# Altium schematic sheet Sheet1.SchDoc
size A4; SheetNumber: 1; SheetTotal: 1
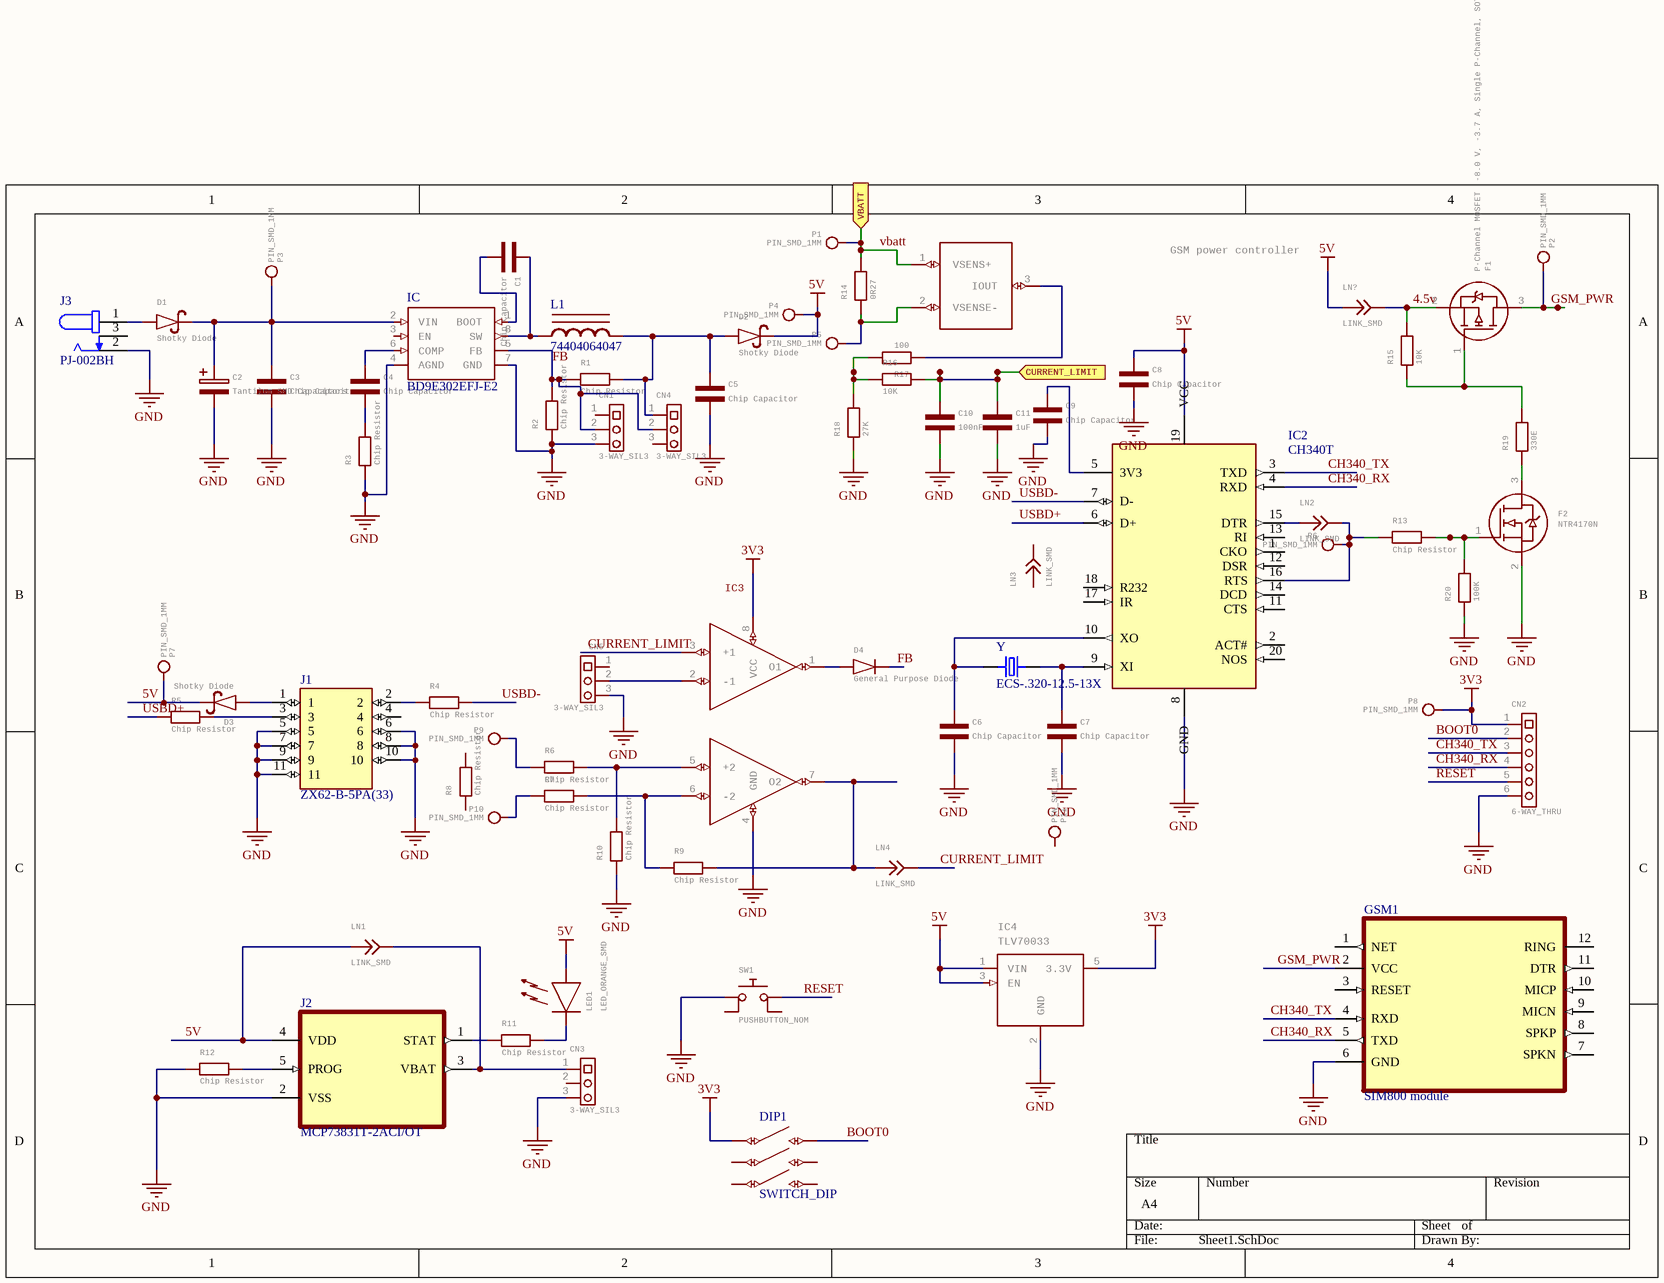
[diagram p0: Sheet1.SchDoc]

## Parts
C1  Chip Capacitor  [C0603]
C2  Tantilum SMD Capacitors  [CT3216]
C3  Chip Capacitor  [C0603]
C4  Chip Capacitor  [PPS_H]
C5  Chip Capacitor  [1210]
C6  Chip Capacitor  [L0402]
C7  Chip Capacitor  [L0402]
C8  Chip Capacitor  [C0603]
C9  Chip Capacitor  [PPS_H]
C10  100nF  [C0603]
C11  1uF  [C0805]
CN1  3-WAY_SIL3  [SIL_3]
CN2  6-WAY_THRU  [SIL6_2MM]
CN3  3-WAY_SIL3  [SIL_3]
CN4  3-WAY_SIL3  [SIL_3]
CN5  3-WAY_SIL3  [SIL_3]
D1  Shotky Diode  [SMB]
D2  Shotky Diode  [SMB]
D3  Shotky Diode  [SMB]
D4  General Purpose Diode  [SOD80]
DIP1  SWITCH_DIP  [DIP_SW6]
F1  P-Channel MOSFET  -8.0 V, -3.7 A, Single P-Channel, SOT-23  [SOT23]
F2  NTR4170N  [SOT23]
GSM1  SIM800 module  [SIM800L]
IC  BD9E302EFJ-E2  [SOIC127P600X100-9N]
IC1  ZXCT1107  [SOT23]  (value not drawn)
IC2  CH340T  [SOP63P599X175-20N]
IC3  LM393  [SOIC_8]  (value not drawn)
IC4  TLV70033  [SOT23-5L]
J1  ZX62-B-5PA(33)  [ZX62B5PA33]
J2  MCP73831T-2ACI/OT  [SOT23-5L]
J3  PJ-002BH  [CUI_PJ-002BH]
L1  74404064047  [74404064047]
LED1  LED_ORANGE_SMD  [L0805]
LN1  LINK_SMD  [LINK_SMD]
LN2  LINK_SMD  [LINK_SMD]
LN3  LINK_SMD  [LINK_SMD]
LN4  LINK_SMD  [LINK_SMD]
LN?  LINK_SMD  [LINK_SMD]
P1  PIN_SMD_1MM  [PAD_SMD_1MM]
P2  PIN_SMD_1MM  [PAD_SMD_1MM]
P3  PIN_SMD_1MM  [PAD_SMD_1MM]
P4  PIN_SMD_1MM  [PAD_SMD_1MM]
P5  PIN_SMD_1MM  [PAD_SMD_1MM]
P6  PIN_SMD_1MM  [PAD_SMD_1MM]
P7  PIN_SMD_1MM  [PAD_SMD_1MM]
P8  PIN_SMD_1MM  [PAD_SMD_1MM]
P9  PIN_SMD_1MM  [PAD_SMD_1MM]
P10  PIN_SMD_1MM  [PAD_SMD_1MM]
P11  PIN_SMD_1MM  [PAD_SMD_1MM]
R1  Chip Resistor  [R0603]
R2  Chip Resistor  [R0603]
R3  Chip Resistor  [R0603]
R4  Chip Resistor  [R0603]
R5  Chip Resistor  [R0603]
R6  Chip Resistor  [R0603]
R7  Chip Resistor  [R0603]
R8  Chip Resistor  [R1206]
R9  Chip Resistor  [R0603]
R10  Chip Resistor  [R0603]
R11  Chip Resistor  [R0603]
R12  Chip Resistor  [R0603]
R13  Chip Resistor  [R0603]
R14  0R27  [R1206]
R15  10K  [R0603]
R16  10K  [R0603]
R17  100  [R0603]
R18  27K  [R0603]
R19  330E  [R0603]
R20  100K  [R0603]
SW1  PUSHBUTTON_NOM  [TACTILE_SMD]
Y  ECS-.320-12.5-13X  [XTAL_ECS-200-20-1X]

## Ports
CURRENT_LIMIT (in), VBATT (in)

## Nets
3V3: CN2.1 DIP1.1 IC3.8(VCC) IC4.5(3.3V) P8.1
5V: C8.1 D2.C(K) D3.C(K) IC4.1(VIN) IC4.3(EN) J2.4(VDD) LED1.A LN1.2 LN?.2 P4.1 P7.1
GND: C2.2 C3.2 C5.2 C6.2 C7.2 C8.2 C9.2 C10.2 C11.2 CN1.3 CN2.6 CN3.3 CN5.3 F2.2(S) GSM1.6(GND) IC.4(AGND) IC.7(GND) IC3.4(GND) IC4.2(GND) J1.5 J1.6 J1.7 J1.8 J1.9 J1.10 J1.11 J2.2(VSS) J3.2 R2.1 R3.1 R10.1 R12.1 R18.1 R20.1 SW1.1
4.5v: F1.2(S) LN?.1 R15.2
BOOT0: CN2.2 DIP1.6
CH340_RX: CN2.4 GSM1.5(TXD) IC2.4(RXD)
CH340_TX: CN2.3 GSM1.4(RXD) IC2.3(TXD)
CURRENT_LIMIT: IC3.3(+1) LN4.1
CURRENT_LIMIT: C10.1 C11.1 R16.2 ; port CURRENT_LIMIT  [a separate net that carries the same name]
FB: CN1.2 CN4.2 D4.2(K) IC.5(FB) R1.1 R2.2
GSM_PWR: F1.3(D) GSM1.2(VCC) P2.1
RESET: CN2.5 SW1.3
USBD+: IC2.6(D+) R5.1
USBD-: IC2.7(D-) R4.2
vbatt: IC1.1(VSENS+) P1.1 R14.2 ; port VBATT
NetC1_1: C1.1 IC.8(SW) L1.1
NetC1_2: C1.2 IC.1(BOOT)
NetC2_1: C2.1 C3.1 D1.C(K) IC.2(VIN) P3.1
NetC4_1: C4.1 IC.6(COMP)
NetC4_2: C4.2 R3.2
NetC5_1: C5.1 CN4.1 D2.A L1.2 R1.2
NetC6_1: C6.1 IC2.10(XO) Y.1
NetC7_1: C7.1 IC2.9(XI) Y.2
NetC9_1: C9.1 IC2.5(3V3)
NetCN3_1: CN3.1 J2.3(VBAT) LN1.1
NetCN5_2: CN5.2 IC3.2(-1)
NetD1_A: D1.A J3.1
NetD3_A: D3.A J1.1
NetD4_1: D4.1(A) IC3.1(O1)
NetF1_1: F1.1(G) R15.1 R19.2
NetF2_1: F2.1(G) R13.2 R20.2
NetF2_3: F2.3(D) R19.1
NetIC1_2: IC1.2(VSENSE-) P5.1 R14.1
NetIC1_3: IC1.3(IOUT) R17.1
NetIC2_15: IC2.15(DTR) LN2.2
NetIC2_16: IC2.16(RTS) LN2.1 P6.1 R13.1
NetIC3_5: IC3.5(+2) R6.2 R10.2
NetIC3_6: IC3.6(-2) R7.2 R9.1
NetIC3_7: IC3.7(O2) LN4.2 R9.2
NetJ1_2: J1.2 R4.1
NetJ1_3: J1.3 R5.2
NetJ2_1: J2.1(STAT) R11.1
NetJ2_5: J2.5(PROG) R12.2
NetLED1_C: LED1.C(K) R11.2
NetP9_1: P9.1 R6.1
NetP10_1: P10.1 R7.1
NetR16_1: R16.1 R17.2 R18.2

Not connected (* = marked no-connect by the designer): CN1 1; CN3 2; CN4 3; CN5 1; DIP1 3 4 5; GSM1 1(NET) 3(RESET) 7(SPKN) 8(SPKP) 9(MICN) 10(MICP) 11(DTR) 12(RING); IC 3(EN); IC2 1(CKO) 2(ACT#) 8(GND) 11(CTS) 12(DSR) 13(RI) 14(DCD) 17(IR) 18(R232) 19(VCC) 20(NOS); J1 4; J3 3; LN3 1 2; P11 1; R8 1 2; SW1 2 4

## Notes on the sheet
- GSM power controller

## Library data of the parts
C1 C3 C8 = CHIP-CAP_100NF: GateName_1: G$1; SymbolName_1: NO_POLARITY; DeviceName: _100NF; LibraryName: Cellstop_Parts; DeviceSetName: CHIP-CAP; Package: C0603
C2 = TANT-CAP_10UF: GateName_1: G$1; SymbolName_1: WITH_POLARITY; DeviceName: _10UF; LibraryName: Cellstop_Parts; DeviceSetName: TANT-CAP; Package: CT3216
C4 C9 = CHIP-CAP_10NF: GateName_1: G$1; SymbolName_1: NO_POLARITY; DeviceName: _10NF; LibraryName: Cellstop_Parts; DeviceSetName: CHIP-CAP; Package: PPS_H
C5 = CHIP-CAP_4.7UF: GateName_1: G$1; SymbolName_1: NO_POLARITY; DeviceName: _4.7UF; LibraryName: Cellstop_Parts; DeviceSetName: CHIP-CAP; Package: 1210
C6 C7 = CHIP-CAP_1.5P: GateName_1: G$1; SymbolName_1: NO_POLARITY; DeviceName: _1.5P; LibraryName: Cellstop_Parts; DeviceSetName: CHIP-CAP; Package: L0402
C10 = CHIP-CAP_100NF: Chip Capacitor; GateName_1: G$1; SymbolName_1: NO_POLARITY; DeviceName: _100NF; LibraryName: Cellstop_Parts; DeviceSetName: CHIP-CAP
C11 = CHIP-CAP_1UF: Chip Capacitor; GateName_1: G$1; SymbolName_1: NO_POLARITY; DeviceName: _1UF; LibraryName: Cellstop_Parts; DeviceSetName: CHIP-CAP
CN1 CN3-CN5 = 3-WAY_SIL3: GateName_1: G$1; SymbolName_1: CON_3_WAY; DeviceName: _SIL3; DeviceSetName: 3-WAY; LibraryName: Cellstop_Parts; Package: SIL_3
CN2 = 6-WAY_THRU: GateName_1: G$1; SymbolName_1: CON_6_WAY; DeviceName: _THRU; DeviceSetName: 6-WAY; LibraryName: Cellstop_Parts; Package: SIL6_2MM
D1-D3 = DIODE-SHOTKY_SS24: GateName_1: G$1; DeviceName: _SS24; SymbolName_1: SHOTKY; LibraryName: Cellstop_Parts; DeviceSetName: DIODE-SHOTKY; Package: SMB
D4 = DIODE_LL4148: GateName_1: G$1; SymbolName_1: DIODE; DeviceName: _LL4148; LibraryName: Cellstop_Parts; DeviceSetName: DIODE; Package: SOD80
F1 = MOSFET_NTR2101P: GateName_1: G$1; SymbolName_1: P-CHAN-3PIN; DeviceName: _NTR2101P; LibraryName: Cellstop_Parts; DeviceSetName: MOSFET; Package: SOT23
F2 = NTR4170N: GateName_1: G$1; SymbolName_1: N-CHAN-3PIN; DeviceName: N; LibraryName: fets; DeviceSetName: NTR4170; CELLSTOPCODE: CELLSTOPCODE; LOCATION: LOCATION; SUPPLIER: Arrow Altech; SUPPLIERCODE: SUPPLIERCODE
GSM1 = SIM800_Module
IC1 = ZXCT1107: GateName_1: G$1; SymbolName_1: ZXCT1107; LibraryName: Cellstop_Parts; DeviceSetName: ZXCT1107
IC3 = LM393: GateName_1: G$1; SymbolName_1: LM393; LibraryName: Cellstop_Parts; DeviceSetName: LM393; Package: SOIC_8
IC4 = TLV70033: GateName_1: G$1; SymbolName_1: TLV70033; LibraryName: Cellstop_Parts; DeviceSetName: TLV70033; Package: SOT23-5L
J1 = ZX62-B-5PA(33): USB - micro B USB 2.0 Receptacle Connector 5 Position Surface Mount, Right Angle; MF: Hirose Electric Co Ltd; SnapEDA_Link: https://www.snapeda.com/parts/ZX62-B-5PA(33)/Hirose/view-part/?ref=snap; Package: None; Value: *; MP: ZX62-B-5PA(33); Check_prices: https://www.snapeda.com/parts/ZX62-B-5PA(33)/Hirose/view-part/?ref=eda
J2 = MCP73831T-2ACI/OT: Charger IC Lithium Ion/Polymer SOT-23-5; MF: Microchip; Package: SOT-23 Microchip; Purchase-URL: https://pricing.snapeda.com/search/part/MCP73831T-2ACI/OT/?ref=eda; MP: MCP73831T-2ACI/OT; Value: *; Availability: In Stock; SnapEDA_Link: https://www.snapeda.com/parts/MCP73831T-2ACI/OT/Microchip/view-part/?ref=snap; Price: None; Check_prices: https://www.snapeda.com/parts/MCP73831T-2ACI/OT/Microchip/view-part/?ref=eda
J3 = PJ-002BH: 2.5 x 6.5 mm, 5.0 A, Horizontal, Through Hole, Dc Power Jack Connector; MF: CUI Devices; SnapEDA_Link: https://www.snapeda.com/parts/PJ-002BH/CUI+Devices/view-part/?ref=snap; Package: None; Value: *; CUI_purchase_URL: https://www.cuidevices.com/product/interconnect/connectors/dc-power-connectors/jacks/pj-002bh?utm_source=snapeda.com&utm_medium=referral&utm_campaign=snapedaBOM; MP: PJ-002BH; Check_prices: https://www.snapeda.com/parts/PJ-002BH/CUI+Devices/view-part/?ref=eda
LED1 = LED_ORANGE_SMD: GateName_1: G$1; SymbolName_1: LED; DeviceName: _ORANGE_SMD; LibraryName: Cellstop_Parts; DeviceSetName: LED; Package: L0805
LN1-LN4 LN? = LINK_SMD: GateName_1: G$1; SymbolName_1: LINK; DeviceName: _SMD; LibraryName: Cellstop_Parts; DeviceSetName: LINK; Package: LINK_SMD
P1-P11 = PIN_SMD_1MM: GateName_1: G$1; SymbolName_1: PIN; DeviceName: _SMD_1MM; LibraryName: Cellstop_Parts; DeviceSetName: PIN; Package: PAD_SMD_1MM
R1 R3 R12 = CHIP-RESISTOR_10K: GateName_1: G$1; DeviceName: _10K; SymbolName_1: RESISTOR; LibraryName: Cellstop_Parts; DeviceSetName: CHIP-RESISTOR; Package: R0603
R2 R6 R7 R9-R11 R13 = CHIP-RESISTOR_1K: GateName_1: G$1; DeviceName: _1K; SymbolName_1: RESISTOR; LibraryName: Cellstop_Parts; DeviceSetName: CHIP-RESISTOR; Package: R0603
R4 R5 = CHIP-RESISTOR_10E: GateName_1: G$1; DeviceName: _10E; SymbolName_1: RESISTOR; LibraryName: Cellstop_Parts; DeviceSetName: CHIP-RESISTOR; Package: R0603
R8 = CHIP-RESISTOR_1206_0R27: GateName_1: G$1; SymbolName_1: RESISTOR; DeviceName: _1206_0R27; LibraryName: Cellstop_Parts; DeviceSetName: CHIP-RESISTOR; Package: R1206
R14 = CHIP-RESISTOR_1206_0R27: Chip Resistor; GateName_1: G$1; SymbolName_1: RESISTOR; DeviceName: _1206_0R27; LibraryName: Cellstop_Parts; DeviceSetName: CHIP-RESISTOR
R15 = CHIP-RESISTOR_10K: Chip Resistor; GateName_1: G$1; DeviceName: _10K; SymbolName_1: RESISTOR; LibraryName: resistors; DeviceSetName: CHIP-RESISTOR; CELLSTOPCODE: CELLSTOPCODE; LOCATION: LOCATION; SUPPLIER: Arrow Altech; SUPPLIERCODE: SUPPLIERCODE
R16 R17 = CHIP-RESISTOR_1K: Chip Resistor; GateName_1: G$1; DeviceName: _1K; SymbolName_1: RESISTOR; LibraryName: Cellstop_Parts; DeviceSetName: CHIP-RESISTOR
R18 R20 = CHIP-RESISTOR_100K: Chip Resistor; GateName_1: G$1; DeviceName: _100K; SymbolName_1: RESISTOR; DeviceSetName: CHIP-RESISTOR
  R18: LibraryName: Cellstop_Parts
  R20: LibraryName: resistors; CELLSTOPCODE: CELLSTOPCODE; LOCATION: LOCATION; SUPPLIER: Arrow Altech; SUPPLIERCODE: SUPPLIERCODE
R19 = CHIP-RESISTOR_330E: Chip Resistor; GateName_1: G$1; DeviceName: _330E; SymbolName_1: RESISTOR; LibraryName: resistors; DeviceSetName: CHIP-RESISTOR; CELLSTOPCODE: CELLSTOPCODE; LOCATION: LOCATION; SUPPLIER: Arrow Altech; SUPPLIERCODE: SUPPLIERCODE
SW1 = PUSHBUTTON_NOM: GateName_1: G$1; SymbolName_1: SWITCH_NO_PUSH; DeviceName: M; LibraryName: Cellstop_Parts; DeviceSetName: PUSHBUTTON_NO; Package: TACTILE_SMD
Y = ECS-.320-12.5-13X: 32kHz Â±30ppm Crystal 12.5pF Cylindrical Can, Radial; MF: ECS Inc.; MP: ECS-.320-12.5-13X; Package: Cylindrical Can Radial  ECS International; Availability: Unavailable; Price: None; SnapEDA_Link: https://www.snapeda.com/parts/ECS-.320-12.5-13X/ECS%20Inc./view-part/561753/?ref=snap; Value: *